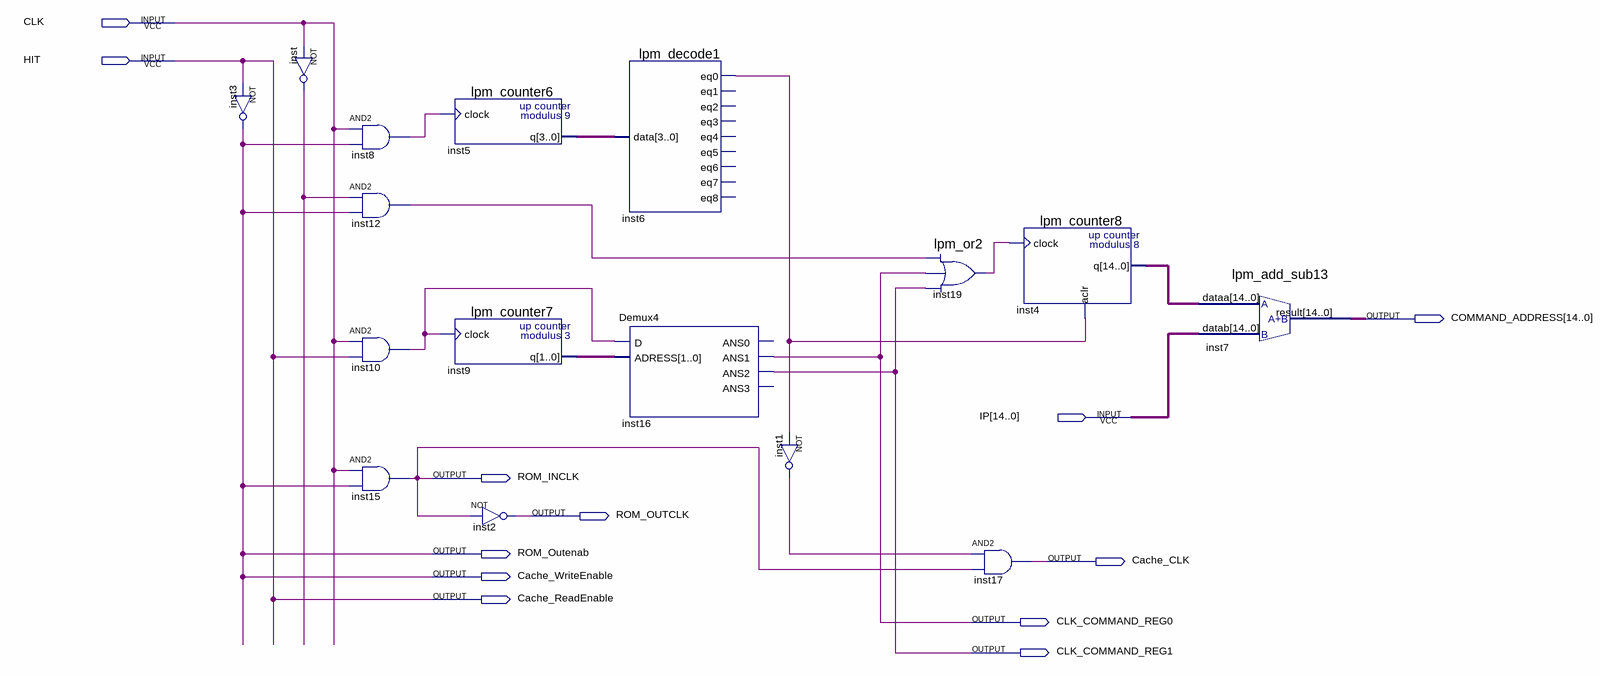
[diagram p0: schematic sheet]
// Quartus schematic LoadCommandAlgorithm.bdf as structural Verilog: 16 symbols, 12 pins
module LoadCommandAlgorithm (
  input  CLK,
  input  HIT,
  input  [14:0] IP,
  output [14:0] COMMAND_ADDRESS,
  output ROM_INCLK,
  output ROM_OUTCLK,
  output ROM_Outenab,
  output Cache_CLK,
  output Cache_WriteEnable,
  output Cache_ReadEnable,
  output CLK_COMMAND_REG0,
  output CLK_COMMAND_REG1
);

  wire inst1_out, inst6_eq0, inst8_out, inst10_out, inst12_out, inst19_result, inst_out;
  wire [1:0] inst9_q;
  wire [3:0] inst5_q;
  wire [14:0] inst4_q;

  not inst3 (Cache_WriteEnable, HIT);
  not inst (inst_out, CLK);
  and inst8 (inst8_out, CLK, Cache_WriteEnable);
  and inst12 (inst12_out, inst_out, Cache_WriteEnable);
  and inst10 (inst10_out, CLK, HIT);
  and inst15 (ROM_INCLK, CLK, Cache_WriteEnable);
  lpm_counter6 inst5 (.clock(inst8_out), .q(inst5_q));
  lpm_counter7 inst9 (.clock(inst10_out), .q(inst9_q));
  not inst2 (ROM_OUTCLK, ROM_INCLK);
  lpm_decode1 inst6 (.data(inst5_q), .eq0(inst6_eq0));  // open: eq1, eq2, eq3, eq4, eq5, eq6, eq7, eq8
  Demux4 inst16 (
    .D(inst10_out), .ADRESS(inst9_q), .ANS1(CLK_COMMAND_REG0), .ANS2(CLK_COMMAND_REG1));  // open: ANS0, ANS3
  not inst1 (inst1_out, inst6_eq0);
  lpm_or2 inst19 (.data0(inst12_out), .data1(CLK_COMMAND_REG0), .data2(CLK_COMMAND_REG1), .result(inst19_result));
  lpm_counter8 inst4 (.clock(inst19_result), .aclr(inst6_eq0), .q(inst4_q));
  and inst17 (Cache_CLK, inst1_out, ROM_INCLK);
  lpm_add_sub13 inst7 (.dataa(inst4_q), .datab(IP), .result(COMMAND_ADDRESS));

  assign Cache_ReadEnable = HIT;
  assign ROM_Outenab = Cache_WriteEnable;
endmodule
